# Altium schematic sheet MCU.SchDoc: STM32WB05xZ
size A4; Date: *******; ApprovedBy: *******; CheckedBy: Alberte Gil; Author: *******; CompanyName: *******; DrawnBy: Mario de Miguel; Engineer: *******; Organization: *******; Address1: *******; Address2: *******; Address3: *******; Address4: *******; DocumentNumber: 3; Revision: *******; SheetNumber: 3; SheetTotal: 5; CurrentTime: *******; CurrentDate: *******; Time: *******; DocumentFullPathAndName: *******; DocumentName: *******; ModifiedDate: *******; ImagePath: *******; ProjectName: *******; Application_BuildNumber: *******
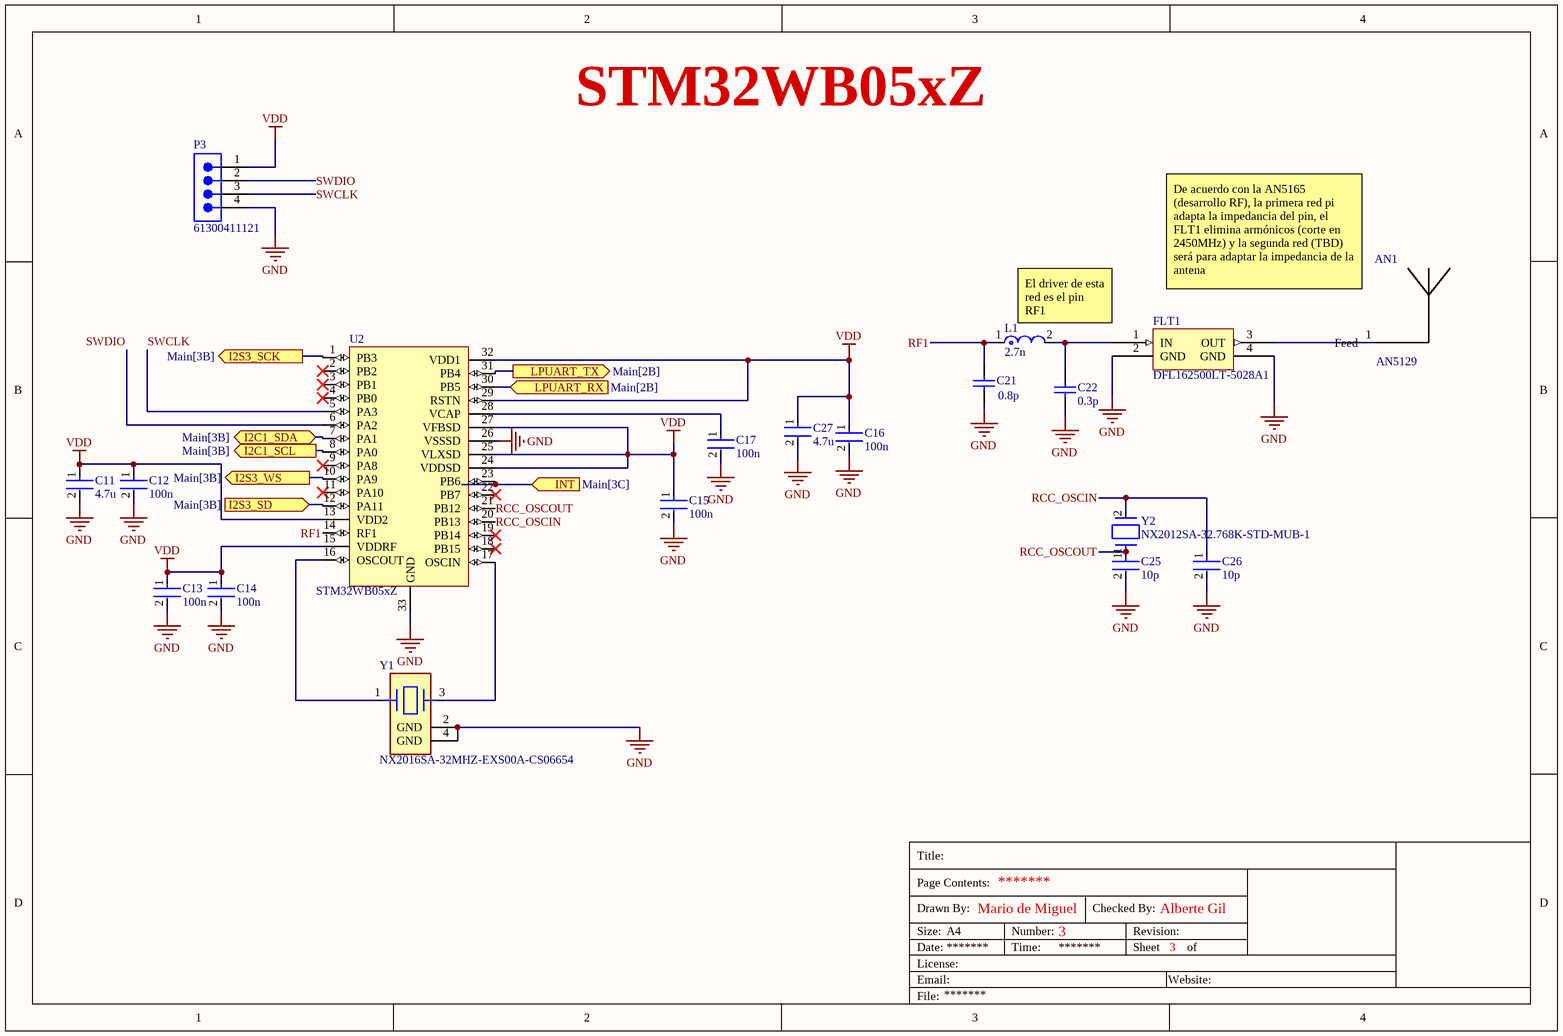
[diagram p0: MCU.SchDoc]

## Parts
AN1  AN5129  [AN5129]
C11  4.7u  [FP-GRM155-0_15-MFG]
C12  100n  [FP-GRM033-0_03-MFG]
C13  100n  [FP-GRM033-0_03-MFG]
C14  100n  [FP-GRM033-0_03-MFG]
C15  100n  [FP-GRM033-0_03-MFG]
C16  100n  [FP-GRM033-0_03-MFG]
C17  100n  [FP-GRM033-0_03-MFG]
C21  0.8p  [CAPC1005X55X25LL05T10]
C22  0.3p  [CAPC1005X55X25NL05T10]
C25  10p  [FP-GRM033-0_03-IPC_A]
C26  10p  [FP-GRM033-0_03-IPC_A]
C27  4.7u  [FP-GRM155-0_15-MFG]
FLT1  DFL162500LT-5028A1  [PCBComponent_1]
L1  2.7n  [FP-LQG15HH_02-IPC_C]
P3  61300411121  [61300411121]
U2  STM32WB05xZ  [STM32WB05XZ]
Y1  NX2016SA-32MHZ-EXS00A-CS06654  [FP-NX2016SA-MFG]
Y2  NX2012SA-32.768K-STD-MUB-1  [FP-NX2012SA-MFG]

## Ports
I2C1_SCL (out, see Main[3B]), I2C1_SDA (bidir, see Main[3B]), I2S3_SCK (out, see Main[3B]), I2S3_SD (in, see Main[3B]), I2S3_WS (out, see Main[3B]), INT (in, see Main[3C]), LPUART_RX (in, see Main[2B]), LPUART_TX (out, see Main[2B])

## Nets
GND: C11.2 C12.2 C13.2 C14.2 C15.2 C16.2 C17.2 C21.1 C22.1 C25.2 C26.2 C27.2 FLT1.2(GND) FLT1.4(GND) P3.4 U2.26(VSSSD) U2.33(GND) Y1.2(GND) Y1.4(GND)
VDD: C11.1 C12.1 C13.1 C14.1 C15.1 C16.1 C27.1 P3.1 U2.13(VDD2) U2.15(VDDRF) U2.24(VDDSD) U2.25(VLXSD) U2.27(VFBSD) U2.29(RSTN) U2.32(VDD1)
I2C1_SCL: U2.8(PA0) ; port I2C1_SCL
I2C1_SDA: U2.7(PA1) ; port I2C1_SDA
I2S3_SCK: U2.1(PB3) ; port I2S3_SCK
I2S3_SD: U2.12(PA11) ; port I2S3_SD
I2S3_WS: U2.10(PA9) ; port I2S3_WS
INT: U2.23(PB6) ; port INT
LPUART_RX: U2.30(PB5) ; port LPUART_RX
LPUART_TX: U2.31(PB4) ; port LPUART_TX
RCC_OSCIN: C26.1 U2.20(PB13) Y2.2
RCC_OSCOUT: C25.1 U2.21(PB12) Y2.1
RF1: C21.2 L1.1 U2.14(RF1)
SWCLK: P3.3 U2.5(PA3)
SWDIO: P3.2 U2.6(PA2)
NetAN1_1: AN1.1(Feed) FLT1.3(OUT)
NetC17_1: C17.1 U2.28(VCAP)
NetC22_2: C22.2 FLT1.1(IN) L1.2
NetU2_16: U2.16(OSCOUT) Y1.1
NetU2_17: U2.17(OSCIN) Y1.3

Not connected (* = marked no-connect by the designer): U2 2(PB2)* 3(PB1)* 4(PB0)* 9(PA8)* 11(PA10)* 18(PB15)* 19(PB14)* 22(PB7)*

## Notes on the sheet
- De acuerdo con la AN5165 (desarrollo RF), la primera red pi adapta la impedancia del pin, el FLT1 elimina armónicos (corte en 2450MHz) y la segunda red (TBD) será para adaptar la impedancia de la antena
- (near L1) El driver de esta red es el pin RF1
- Title:
- Drawn By:
- Page Contents:
- Checked By:
- Size:
- Date:
- File:
- License:
- Email:
- A4
- Number:
- Time:
- Revision:
- Sheet
- Website:
- of

## Library data of the parts
C11 C27 = CMP-06035-003573-1: Chip Multilayer Ceramic Capacitors for General Purpose, 0402, 4.7uF, X5R, 15%, 20%, 10V; Case/Package: 0402; Voltage Rating: 10V; Min Operating Temperature: -55°C; Mount: Surface Mount; Packaging: Tape and Reel; Max Operating Temperature: 85°C; Capacitance: 4.7uF; Case Code (Metric): 1005; Case Code (Imperial): 0402; Tolerance: 20%
C12-C17 = CMP-06035-019037-1: Chip Multilayer Ceramic Capacitors for General Purpose, 0201, 0.10uF, X7S, 22%, 10%, 16V; Capacitance: 100nF; Dielectric: X7S; Tolerance: 10%; Voltage Rating (DC): 16V; Height: 0.3mm; Max Operating Temperature: 125°C; Case Code (Metric): 0603; Termination: SMD/SMT; Min Operating Temperature: -55°C; Mount: Surface Mount; Case/Package: 0201; Weight: 1.2E-05oz; Package Quantity: 15000; Length: 0.024inch; Voltage Rating: 16V; Case Code (Imperial): 0201; Packaging: Tape and Reel; Thickness: 0.013inch; Width: 0.3mm
C21 = CMP-1034-00043-2: Part Number: GRM1555C1HR80BA01D; Manufacturer: Murata
C22 = CMP-1034-00007-2: Part Number: GRM1555C1HR30WA01D; Manufacturer: Murata
C25 C26 = CMP-2010-01302-2: Chip Multilayer Ceramic Capacitors for General Purpose, 0201, 10pF, C0G, 30ppm/°C, 5%, 25V; Length: 0.024inch; Voltage Rating: 25V; Packaging: Tape and Reel; Max Operating Temperature: 125°C; Mount: Surface Mount; Capacitance: 10pF; Tolerance: 5%; Series: GRM; Case Code (Metric): 0603; Package Quantity: 1; Voltage Rating (DC): 25V; Depth: 0.3mm; Min Operating Temperature: -55°C; Width: 0.012inch; Thickness: 0.013inch; Termination: SMD/SMT; Lead Free: Lead Free; Case/Package: 0201; Case Code (Imperial): 0201; Dielectric: C0G; REACH SVHC: No SVHC
L1 = CMP-2000-06580-2: Multilayer type RF Inductor 2.7nH ±0.3nH 0.12Ω 800mA 0402; Max DC Current: 300mA; Q Factor: 8; Core Material: Air; Test Frequency: 100MHz; Shielding: Unshielded; Self Resonant Frequency: 6GHz; DC Resistance (DCR): 150mR; Packaging: Tape and Reel; Depth: 0.55mm; DC Current: 300mA; Length: 1mm; Current Rating: 300mA; Lead Free: Lead Free; Max Operating Temperature: 125°C; Mount: Surface Mount; Height - Seated (Max): 0.022inch; Case Code (Imperial): 0402; Height: 0.5mm; Termination: SMD/SMT; Package Quantity: 10000; Radiation Hardening: No; Width: 0.5mm; Case Code (Metric): 1005; Min Operating Temperature: -55°C; Military Standard: Not; Case/Package: 0402; Inductance: 2.7nH
P3 = CMP-1502-01064-3: NexarPartId: 32855522; Operating Supply Voltage: 250V; Pitch: 2.54mm; Contact Resistance: 20mΩ; Number of Positions: 4; Current Rating: 3A; Connector Type: Male Pin; Gender: Male; Contact Plating: Gold; Height: 8.89mm; Lead Pitch: 2.54mm; Lead Free: Lead Free; Contact Mating Length: 5.9944mm; Number of Rows: 1; Termination: Solder; Packaging: Bulk; REACH SVHC: Unknown; Min Operating Temperature: -40°C; RoHS: Compliant; Number of Contacts: 4; Voltage Rating: 250V; Color: Black; Max Operating Temperature: 105°C; Contact Material: Copper; Mount: Through Hole; Orientation: Vertical; Number of Pins: 4
Y1 = CMP-200220-000017-1: CRYSTAL 32.0000MHZ 8PF SMD; Frequency: 32MHz; ESR (Equivalent Series Resistance): 60R; Ratings: AEC-Q200; Mount: Surface Mount; Case/Package: SMD/SMT; Packaging: Tape and Reel; Load Capacitance: 8pF; Min Operating Temperature: -40°C; Max Operating Temperature: 125°C
Y2 = CMP-200220-000019-1: CRYSTAL 32.7680KHZ 12.5PF SMD; Frequency Tolerance: 20ppm; ESR (Equivalent Series Resistance): 80kR; Frequency: 32.768kHz; Mount: Surface Mount; Packaging: Cut Tape; Min Operating Temperature: -40°C; Max Operating Temperature: 85°C; Case/Package: SMD/SMT; RoHS Compliant: Yes; Length: 0.081inch; Series: NX2012SA; Height: 0.024inch; Width: 0.047inch; Load Capacitance: 12.5pF